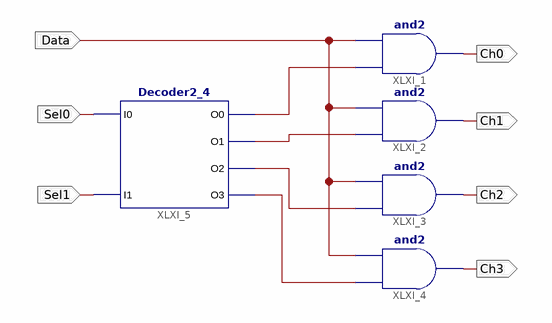
[diagram p0: schematic sheet 1]
// Xilinx ISE schematic Demux1_4.sch (spartan6) as structural Verilog: 5 symbols, 7 ports
module Demux1_4 (
  input  Data,
  input  Sel0,
  input  Sel1,
  output Ch0,
  output Ch1,
  output Ch2,
  output Ch3
);

  wire XLXN_4, XLXN_5, XLXN_6, XLXN_7;

  and XLXI_1 (Ch0, XLXN_4, Data);
  and XLXI_2 (Ch1, XLXN_5, Data);
  and XLXI_3 (Ch2, XLXN_6, Data);
  and XLXI_4 (Ch3, XLXN_7, Data);
  Decoder2_4 XLXI_5 (.I0(Sel0), .I1(Sel1), .O0(XLXN_4), .O1(XLXN_5), .O2(XLXN_6), .O3(XLXN_7));
endmodule
